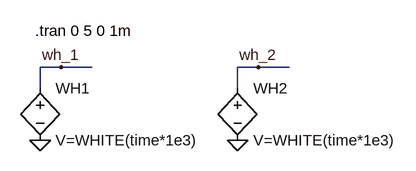
[diagram p0: schematic LM741_5a.asc]
LM741_5a.asc, the LTspice schematic file:
Version 4
SHEET 1 880 680
WIRE 160 64 128 64
WIRE 208 64 160 64
WIRE 464 64 432 64
WIRE 512 64 464 64
WIRE 128 96 128 64
WIRE 432 96 432 64
FLAG 160 64 wh_1
FLAG 464 64 wh_2
FLAG 432 176 0
FLAG 128 176 0
SYMBOL bv 128 80 R0
SYMATTR InstName WH1
SYMATTR Value V=WHITE(time*1e3)
SYMBOL bv 432 80 R0
SYMATTR InstName WH2
SYMATTR Value V=WHITE(time*1e3)
TEXT 120 8 Left 2 !.tran 0 5 0 1m

The netlist it stands for:
* LM741_5a.asc
B§WH1 wh_1 0 V=WHITE(time*1e3)
B§WH2 wh_2 0 V=WHITE(time*1e3)
.tran 0 5 0 1m
.backanno
.end